# EAGLE schematic AVR_ISP_TestCircuit (EAGLE 9.6.2)
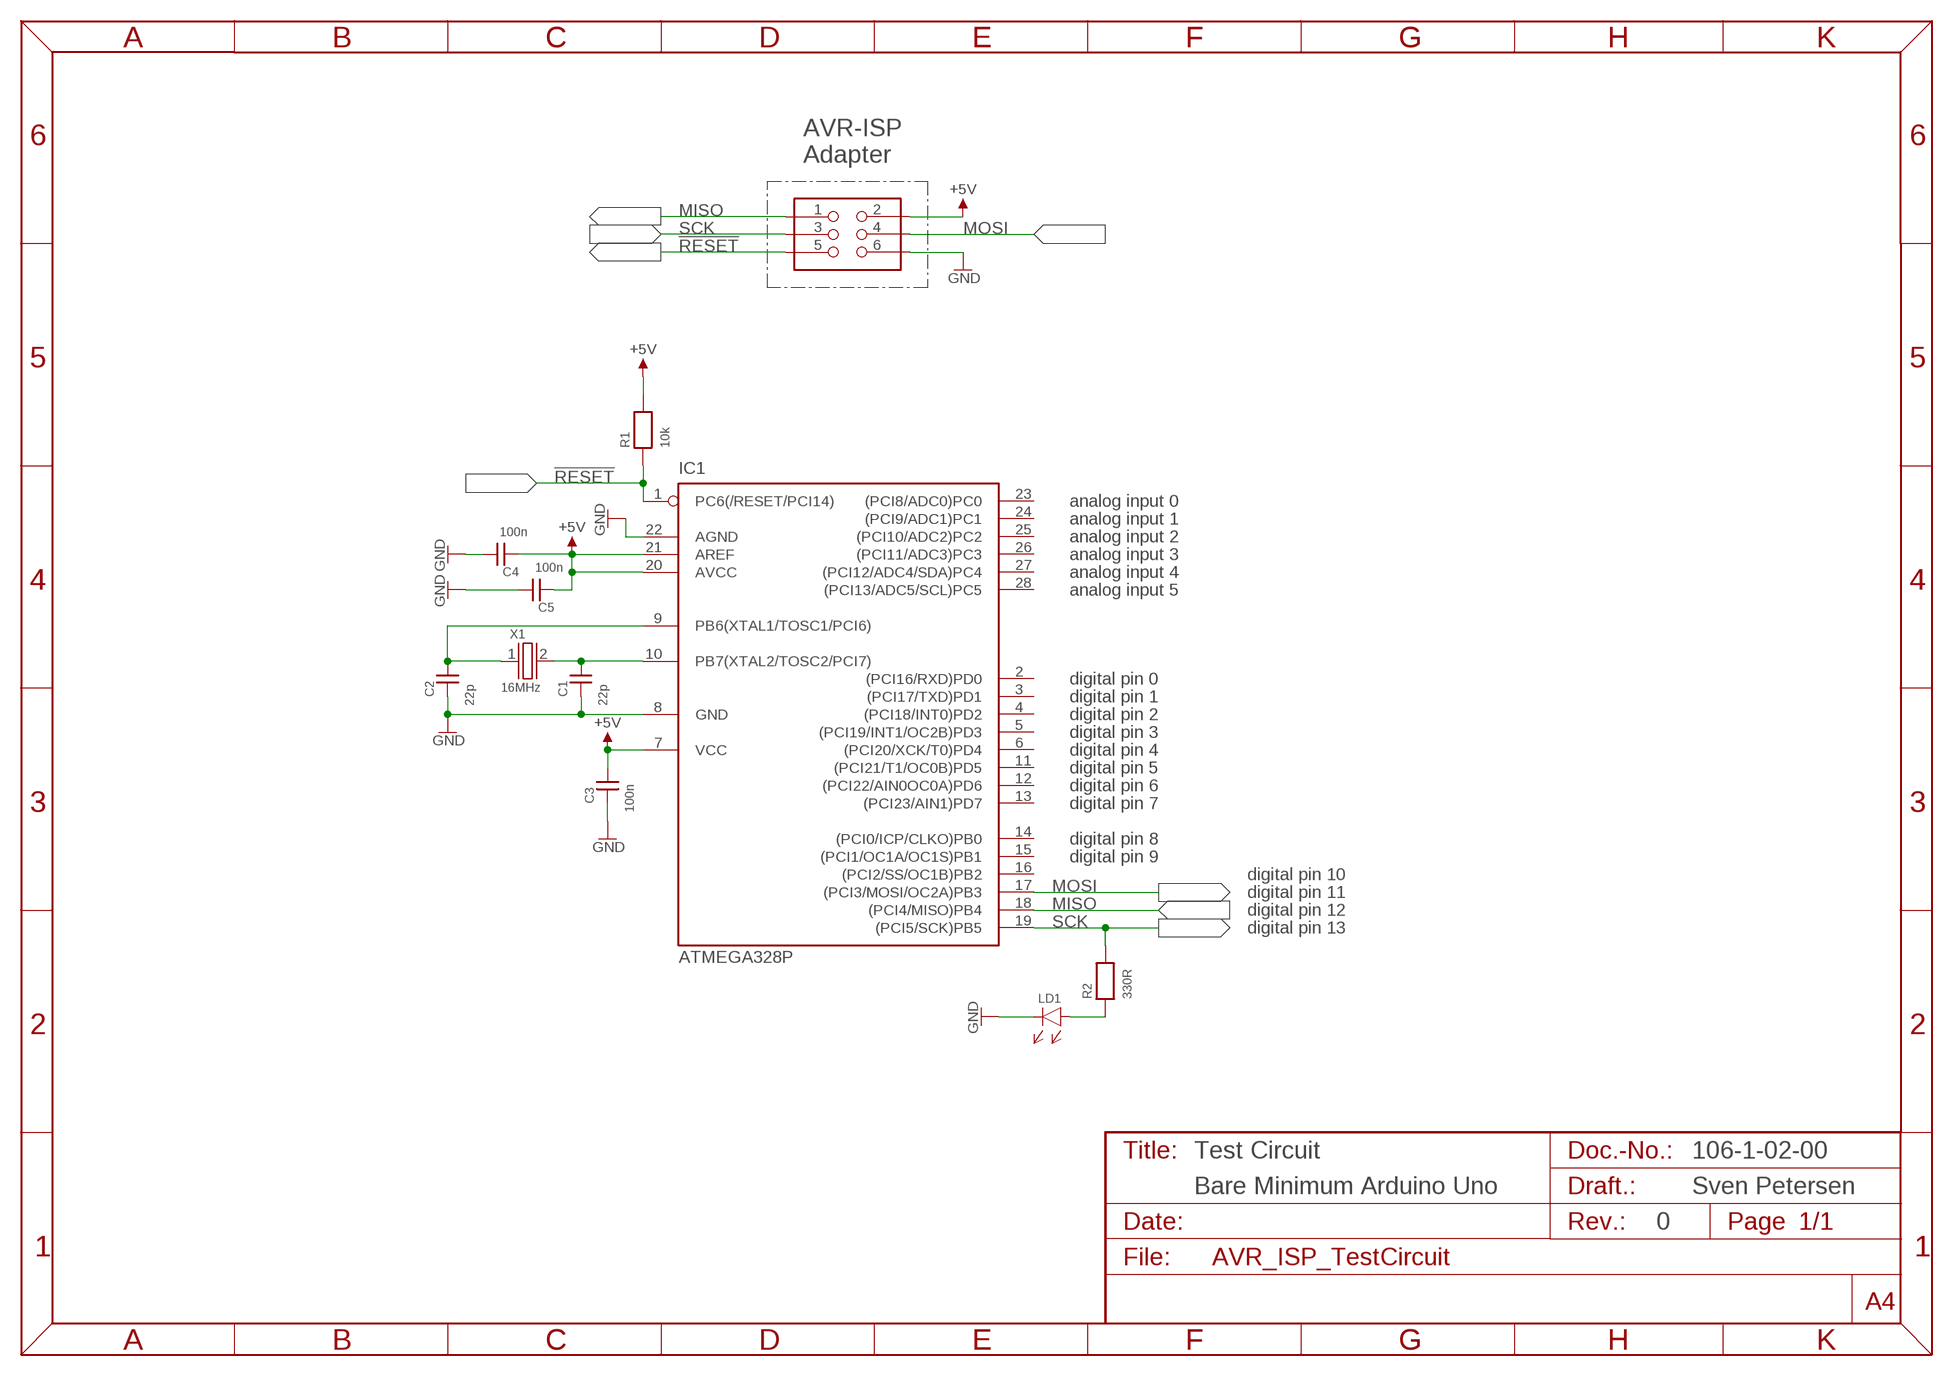
[diagram p0: schematic, sheet 1]

## Parts
C1  22p  CAP02  [C-5]
C2  22p  CAP02  [C-5]
C3  100n  CAP02  [C-5]
C4  100n  CAP02  [C-5]
C5  100n  CAP02  [C-5]
IC1  ATMEGA328P  ATMEGA328PROUND  [DIL28-3-ROUND]
J1  WSL 6G  2X03WV  [2X03WV]
LD1  5MM  [5MM]
R1  10k  RES04  [R-10]
R2  330R  RES04  [R-10]
X1  16MHz  HC49SLF  [HC49SLF]

## Nets
!RESET: IC1.1(PC6(/RESET/PCI14)) J1.5 R1.1
+5V: C3.2 C4.1 C5.1 IC1.7(VCC) IC1.20(AVCC) IC1.21(AREF) J1.2 R1.2
GND: C1.1 C2.1 C3.1 C4.2 C5.2 IC1.8(GND) IC1.22(AGND) J1.6 LD1.C(K)
MISO: IC1.18((PCI4/MISO)PB4) J1.1
MOSI: IC1.17((PCI3/MOSI/OC2A)PB3) J1.4
N$1: LD1.A R2.1
N$4: C1.2 IC1.10(PB7(XTAL2/TOSC2/PCI7)) X1.2
N$5: C2.2 IC1.9(PB6(XTAL1/TOSC1/PCI6)) X1.1
SCK: IC1.19((PCI5/SCK)PB5) J1.3 R2.2
Unconnected: IC1.2((PCI16/RXD)PD0) IC1.3((PCI17/TXD)PD1) IC1.4((PCI18/INT0)PD2) IC1.5((PCI19/INT1/OC2B)PD3) IC1.6((PCI20/XCK/T0)PD4) IC1.11((PCI21/T1/OC0B)PD5) IC1.12((PCI22/AIN0OC0A)PD6) IC1.13((PCI23/AIN1)PD7) IC1.14((PCI0/ICP/CLKO)PB0) IC1.15((PCI1/OC1A/OC1S)PB1) IC1.16((PCI2/SS/OC1B)PB2) IC1.23((PCI8/ADC0)PC0) IC1.24((PCI9/ADC1)PC1) IC1.25((PCI10/ADC2)PC2) IC1.26((PCI11/ADC3)PC3) IC1.27((PCI12/ADC4/SDA)PC4) IC1.28((PCI13/ADC5/SCL)PC5)

## Notes on the sheet
- AVR-ISP
  Adapter
- analog input 0
- analog input 1
- analog input 2
- analog input 3
- analog input 4
- analog input 5
- digital pin 0
- digital pin 1
- digital pin 2
- digital pin 3
- digital pin 4
- digital pin 5
- digital pin 6
- digital pin 7
- digital pin 8
- digital pin 9
- digital pin 10
- digital pin 11
- digital pin 12
- digital pin 13
- Test Circuit | 106-1-02-00
- Bare Minimum Arduino Uno | Sven Petersen
- 0

## Library data of the parts
C1-C5 = DISCRETE:CAP02
IC1 = atmega328:ATMEGA328*P: MICROCONTROLLER 32 kBytes FLASH 2 kBytes SRAM 1 kBytes EEPROM USART 8-channel 10 bit ADC
J1 = PINHEAD:2X03WV; DIST: Reichelt: WSL 6G
LD1 = LED:5MM
R1 R2 = DISCRETE:RES04
X1 = FOX:HC49SLF